# Altium schematic sheet CONTROL.SchDoc: CONTROLS
size A4; DocumentNumber: 15; Revision: 2.0; SheetNumber: 15; SheetTotal: 18
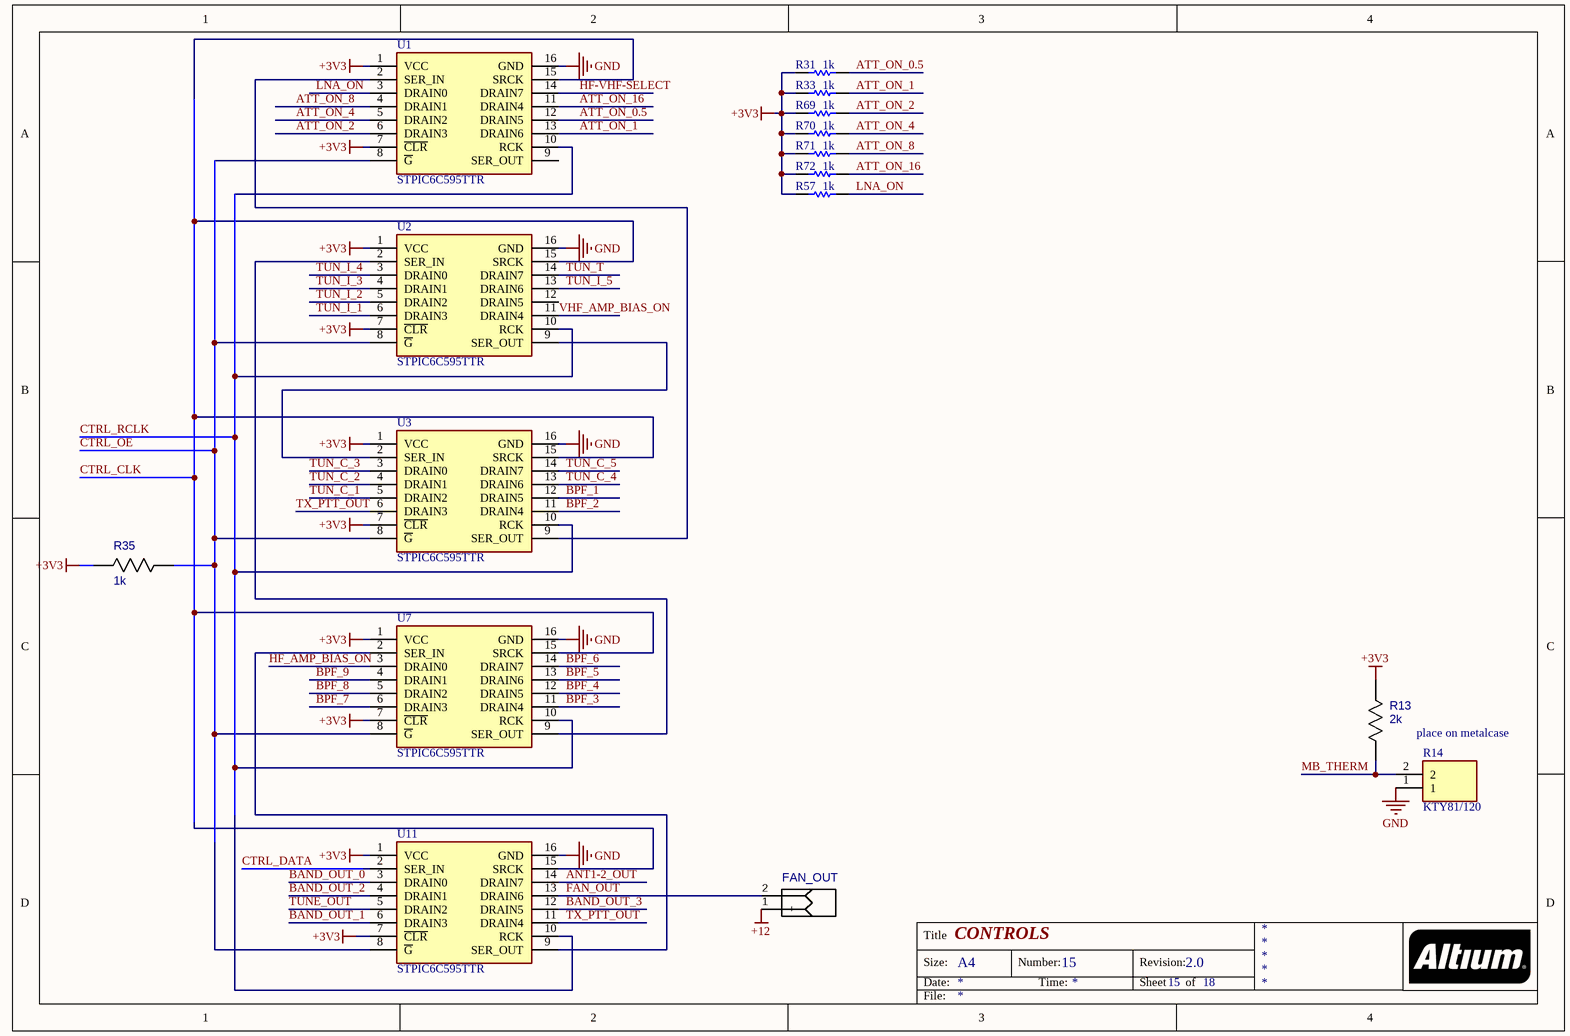
[diagram p0: CONTROL.SchDoc]

## Parts
FAN_OUT  51022-0200  [51022-0200]  (value not drawn)
R13  2k  [RES_0805]
R14  KTY81/120  [TO254P420X460X770-2P]
R31  1k  [RESC2013X60X40NL20T25]
R33  1k  [RESC2013X60X40NL20T25]
R35  1k  [RES_0805]
R57  1k  [RESC2013X60X40NL20T25]
R69  1k  [RESC2013X60X40NL20T25]
R70  1k  [RESC2013X60X40NL20T25]
R71  1k  [RESC2013X60X40NL20T25]
R72  1k  [RESC2013X60X40NL20T25]
U1  STPIC6C595TTR  [SOP65P640X120-16N]
U2  STPIC6C595TTR  [SOP65P640X120-16N]
U3  STPIC6C595TTR  [SOP65P640X120-16N]
U7  STPIC6C595TTR  [SOP65P640X120-16N]
U11  STPIC6C595TTR  [SOP65P640X120-16N]

## Nets
+3V3: R13.2 R31.2 R33.2 R35.1 R57.2 R69.2 R70.2 R71.2 R72.2 U1.1(VCC) U1.7(~{CLR}) U2.1(VCC) U2.7(~{CLR}) U3.1(VCC) U3.7(~{CLR}) U7.1(VCC) U7.7(~{CLR}) U11.1(VCC) U11.7(~{CLR})
+12: FAN_OUT.1(+)
GND: R14.1 U1.16(GND) U2.16(GND) U3.16(GND) U7.16(GND) U11.16(GND)
ANT1-2_OUT: U11.14(DRAIN7)
ATT_ON_0.5: R31.1 U1.12(DRAIN5)
ATT_ON_1: R33.1 U1.13(DRAIN6)
ATT_ON_2: R69.1 U1.6(DRAIN3)
ATT_ON_4: R70.1 U1.5(DRAIN2)
ATT_ON_8: R71.1 U1.4(DRAIN1)
ATT_ON_16: R72.1 U1.11(DRAIN4)
BAND_OUT_0: U11.3(DRAIN0)
BAND_OUT_1: U11.6(DRAIN3)
BAND_OUT_2: U11.4(DRAIN1)
BAND_OUT_3: U11.12(DRAIN5)
BPF_1: U3.12(DRAIN5)
BPF_2: U3.11(DRAIN4)
BPF_3: U7.11(DRAIN4)
BPF_4: U7.12(DRAIN5)
BPF_5: U7.13(DRAIN6)
BPF_6: U7.14(DRAIN7)
BPF_7: U7.6(DRAIN3)
BPF_8: U7.5(DRAIN2)
BPF_9: U7.4(DRAIN1)
CTRL_CLK: U1.15(SRCK) U2.15(SRCK) U3.15(SRCK) U7.15(SRCK) U11.15(SRCK)
CTRL_DATA: U11.2(SER_IN)
CTRL_OE: R35.2 U1.8(~{G}) U2.8(~{G}) U3.8(~{G}) U7.8(~{G}) U11.8(~{G})
CTRL_RCLK: U1.10(RCK) U2.10(RCK) U3.10(RCK) U7.10(RCK) U11.10(RCK)
FAN_OUT: FAN_OUT.2(-) U11.13(DRAIN6)
HF-VHF-SELECT: U1.14(DRAIN7)
HF_AMP_BIAS_ON: U7.3(DRAIN0)
LNA_ON: R57.1 U1.3(DRAIN0)
MB_THERM: R13.1 R14.2
TUN_I_1: U2.6(DRAIN3)
TUN_I_2: U2.5(DRAIN2)
TUN_I_3: U2.4(DRAIN1)
TUN_I_4: U2.3(DRAIN0)
TUN_I_5: U2.13(DRAIN6)
TUN_T: U2.14(DRAIN7)
TUN_С_1: U3.5(DRAIN2)
TUN_С_2: U3.4(DRAIN1)
TUN_С_3: U3.3(DRAIN0)
TUN_С_4: U3.13(DRAIN6)
TUN_С_5: U3.14(DRAIN7)
TUNE_OUT: U11.5(DRAIN2)
TX_PTT_OUT: U3.6(DRAIN3) U11.11(DRAIN4)
VHF_AMP_BIAS_ON: U2.11(DRAIN4)
NetU1_2: U1.2(SER_IN) U3.9(SER_OUT)
NetU2_2: U2.2(SER_IN) U7.9(SER_OUT)
NetU2_9: U2.9(SER_OUT) U3.2(SER_IN)
NetU7_2: U7.2(SER_IN) U11.9(SER_OUT)

Not connected (* = marked no-connect by the designer): U1 9(SER_OUT); U2 12(DRAIN5)

## Notes on the sheet
- place on metalcase
- Title
- Size:
- Date:
- A4
- Number:
- Time:
- Revision:
- Sheet
- of
- File:

## Library data of the parts
R13 R35 = RES_0805
  R35: Value: 1k
R14 = KTY81_110: Integrated Circuit; Manufacturer_Name: Nexperia; Manufacturer_Part_Number: KTY81/110; Datasheet Link: https://www.nxp.com/docs/en/data-sheet/KTY81_SER.pdf; Height: 4.2mm
R31 R33 R57 R69-R72 = CMP-2001-00626-1: RES_0805; Manufacturer: Panasonic; Part Number: ERA-6AEB303V
U1-U3 U7 U11 = STPIC6C595TTR: Integrated Circuit; Manufacturer_Name: STMicroelectronics; Datasheet Link: http://www.st.com/st-web-ui/static/active/en/resource/technical/document/datasheet/CD00020664.pdf; Height: 1.2mm; Manufacturer_Part_Number: STPIC6C595TTR; Mouser Part Number: 511-STPIC6C595T; Mouser Price/Stock: https://www.mouser.co.uk/ProductDetail/STMicroelectronics/STPIC6C595TTR?qs=Pgvhs884FskRYYZkj3y%2FSg%3D%3D; Arrow Part Number: STPIC6C595TTR; Arrow Price/Stock: https://www.arrow.com/en/products/stpic6c595ttr/stmicroelectronics